# Altium schematic sheet Supply.SchDoc
size A4
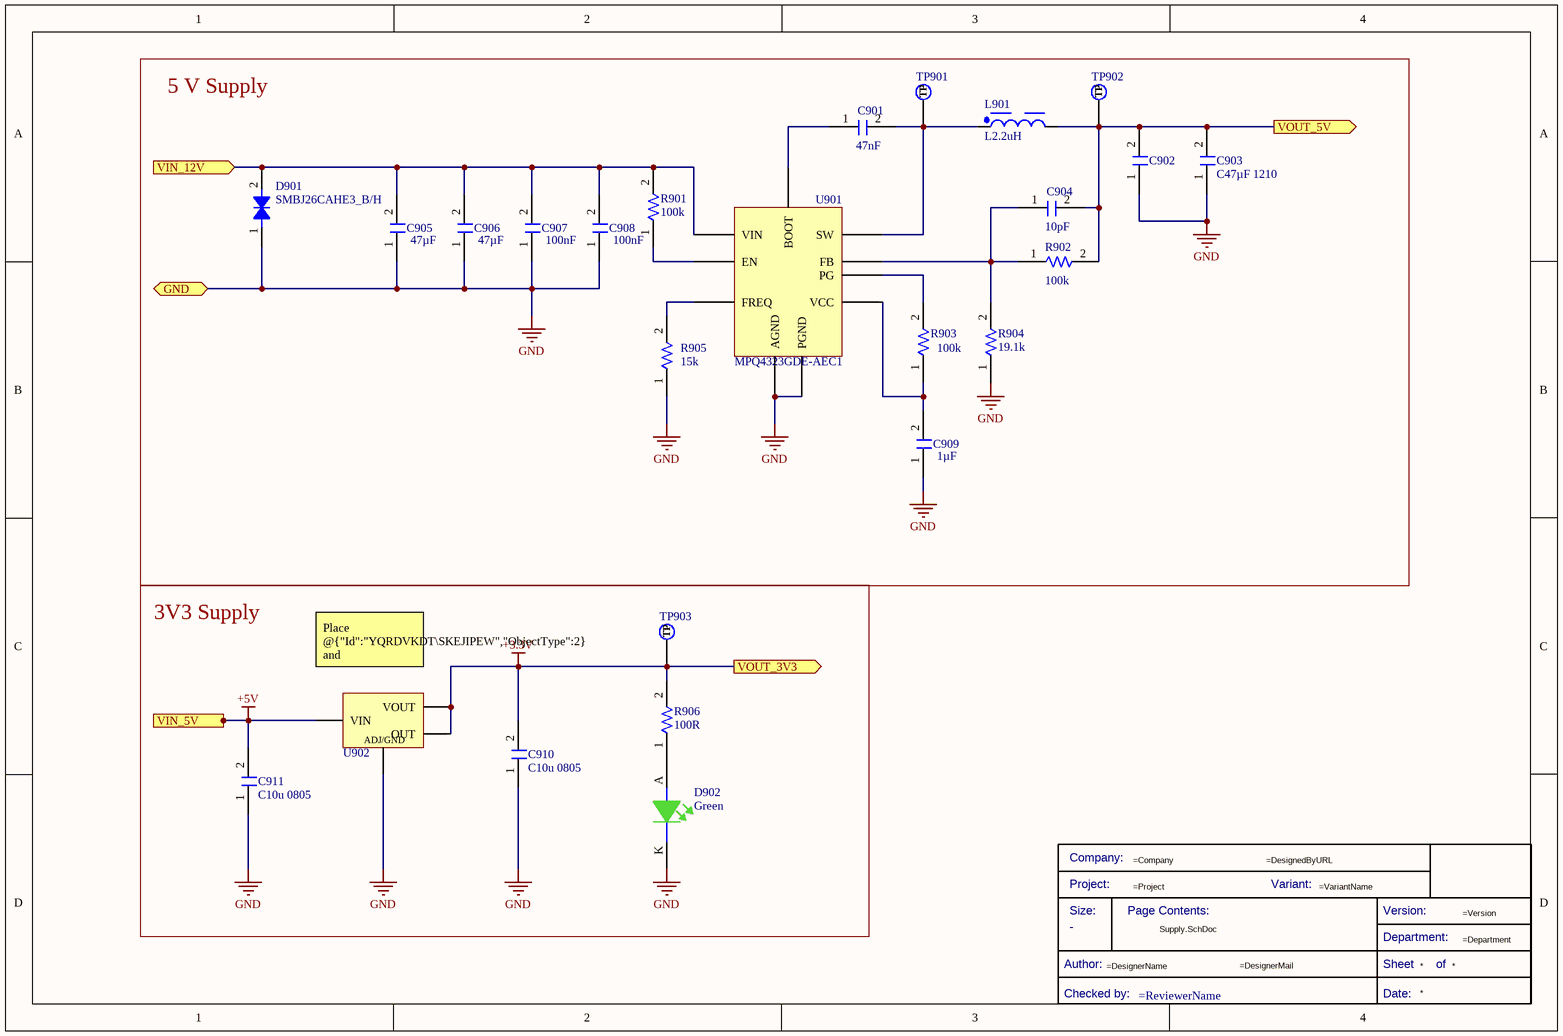
[diagram p0: Supply.SchDoc]

## Parts
*  Title Block_template  (value not drawn)  (graphical)
C901  value 47nF  [WCAP-CSGP_0805_L2W1.25H0.8_Reflow]  (hidden comment: 885012207096)
C902  C47µF 1210  [FP-GRM32E-0_3-0_2-IPC_C]  (value not drawn)
C903  C47µF 1210  [FP-GRM32E-0_3-0_2-IPC_C]
C904  value 10pF  [WCAP-CSGP_0805_L2W1.25H0.6_Reflow]  (hidden comment: C10pF_0805_50V)
C905  value 47µF  [FP-GRM32E-0_3-0_2-IPC_C]  (hidden comment: C47µF-10V-1210)
C906  value 47µF  [FP-GRM32E-0_3-0_2-IPC_C]  (hidden comment: C47µF-10V-1210)
C907  value 100nF  [C0805FNPC-R]  (hidden comment: C100n-50V-0805FNPC-X7R)
C908  value 100nF  [C0805FNPC-R]  (hidden comment: C100n-50V-0805FNPC-X7R)
C909  value 1µF  [C0805FNPC-R]  (hidden comment: C1u-50V-0805FNPC-X7R)
C910  C10u 0805  [C0805FNPC-R]
C911  C10u 0805  [C0805FNPC-R]
D901  SMBJ26CAHE3_B/H  [CAPM3216X18N]
D902  Color: Green  [LED_0805_WE]  (hidden comment: 150080VS75000)
L901  L2.2uH  [WE-PD_7345]
R901  value 100k  [RESC2013X70X40NL20T20]  (hidden comment: R100k-0805)
R902  value 100k  [RESC2013X70X40NL20T20]  (hidden comment: R100k-0805)
R903  value 100k  [RESC2013X70X40NL20T20]  (hidden comment: R100k-0805)
R904  value 19.1k  [0805]  (hidden comment: R19.1k_0805)
R905  value 15k  [RESC2013X50X30ML20T20]  (hidden comment: R15K-0805)
R906  Resistance: 100R  [R0805FTK]  (hidden comment: CR0805-FX-1000ELF)
TP901  TestPoint  [TestPoint]  (value not drawn)  (no BOM)
TP902  TestPoint  [TestPoint]  (value not drawn)  (no BOM)
TP903  TestPoint  [TestPoint]  (value not drawn)  (no BOM)
U901  MPQ4323GDE-AEC1  [MPQ4323]
U902  LM1117IMP-3.3/NOPB  [LDO_10V-0.8/3V3-SOT223]  (value not drawn)

## Blocks framed on the sheet
5 V Supply: C901-C909 D901 L901 R901-R905 TP901 TP902 U901
3V3 Supply: C910 C911 D902 R906 TP903 U902

## Ports
GND (bidir), VIN_5V (in), VIN_12V (in), VOUT_3V3 (out), VOUT_5V (out)

## Nets
+3.3V: C910.2 R906.2 TP903.1(TP) U902.2(OUT) U902.4(VOUT) ; port VOUT_3V3
+5V: C911.2 U902.3(VIN) ; port VIN_5V
GND: C902.1 C903.1 C905.1 C906.1 C907.1 C908.1 C909.1 C910.1 C911.1 D901.1 D902.K R904.1 R905.1 U901.4(AGND) U901.5(PGND) U902.1(ADJ/GND) ; port GND
VIN_12V: C905.2 C906.2 C907.2 C908.2 D901.2 R901.2 U901.1(VIN) ; port VIN_12V
VOUT_5V: C902.2 C903.2 C904.2 L901.2 R902.2 TP902.1(TP) ; port VOUT_5V
NetC901_1: C901.1 U901.10(BOOT)
NetC901_2: C901.2 L901.1 TP901.1(TP) U901.9(SW)
NetC904_1: C904.1 R902.1 R904.2 U901.8(FB)
NetC909_2: C909.2 R903.1 U901.6(VCC)
NetD902_A: D902.A R906.1
NetR901_1: R901.1 U901.2(EN)
NetR903_2: R903.2 U901.7(PG)
NetR905_2: R905.2 U901.3(FREQ)

## Notes on the sheet
- (near U902) Place @{"Id":"YQRDVKDT\SKEJIPEW","ObjectType":2} and @{"Id":"YQRDVKDT\BVAKXSFV","ObjectType":2} near @{"Id":"YQRDVKDT\LSHDRFIT","ObjectType":2}
- (in symbol Title Block_template) Company:; Project:; Variant:; Size:; Page Contents:; Version:; Department:; Author:; Sheet; of; Checked by:; Date:

## Library data of the parts
* = Title Block_template: Standard Title Block; .Creator: GP; Category: Title Block; .PCBcheck: GP; .SCHcheck: GP; Checked by:: =ReviewerName; Size: -
C901 = CMP-001-00011-1: Ceramic Capacitor, Ceramic; RoHS Compliant: Yes; Capacitor Type: Ceramic; Pins: 2
C902 C903 = CMP-001-00003-4: Ceramic Capacitor, Multilayer, Ceramic, 10V, 10% +Tol, 10% -Tol, X6S, 22% TC, 47uF, Surface Mount, 1210; Value: 47µF; Capacitor Type: Ceramic; Min Operating Temperature: -55°C; Pins: 2; RoHS Compliant: Yes; Case/Package: 1210; Max Operating Temperature: 105°C; Mounting Technology: Surface Mount
C904 = CMP-001-00012-2: Ceramic Capacitor, Multilayer, Ceramic, 50V, 5% +Tol, 5% -Tol, C0G, 30ppm/Cel TC, 0.00001uF, Surface Mount, 0805. 885012007051; Pins: 2; RoHS Compliant: Yes; Capacitor Type: Ceramic
C905 C906 = CMP-001-00003-4: Ceramic Capacitor, Multilayer, Ceramic, 10V, 10% +Tol, 10% -Tol, X6S, 22% TC, 47uF, Surface Mount, 1210; Capacitor Type: Ceramic; Min Operating Temperature: -55°C; Pins: 2; RoHS Compliant: Yes; Case/Package: 1210; Max Operating Temperature: 105°C; Mounting Technology: Surface Mount
C907 C908 = CMP-00063-1: Cap, 0.1ΜF, 50V, 10%, X7R, 0805; Manufacturer 1: Wurth Electronics; Manufacturer Part Number 1: 885012207098; .Creator: DR; Pricing 1: 100=0,10200, 500=0,07100, 2000=0,06100 (GBP); ComponentLink1URL: http://www.farnell.com/datasheets/1958498.pdf?src-supplier=Farnell; Design Item ID: C100n-50V-0805FNPC-X7R; Voltage Rating (DC): 50V; Voltage Rating: 50V; Max Operating Temperature: 125°C; RoHS: Yes; Case Code (Metric): 2012; Mount: Surface Mount; REACH SVHC: Unknown; Stock 1: 8000; Source: Passives.SchLib; Tolerance: 10%; RoHS Compliant: Yes; Dielectric: X7R; ComponentLink2Description: http://www.farnell.com/datasheets/1958498.pdf?src-supplier=Element14; ComponentLink2URL: http://www.farnell.com/datasheets/1958498.pdf?src-supplier=Element14; Min Operating Temperature: -55°C; Width: 0.049inch; Category: Ceramic Capacitors; Thickness: 0.035inch; Length: 0.079inch; ComponentLink3URL: https://katalog.we-online.de/pbs/datasheet/885012207098.pdf?src-supplier=Digi-Key; Case/Package: 0805; ComponentLink3Description: https://katalog.we-online.de/pbs/datasheet/885012207098.pdf?src-supplier=Digi-Key; Packaging: Cut Tape; ComponentLink1Description: http://www.farnell.com/datasheets/1958498.pdf?src-supplier=Farnell; ComponentLink4Description: http://www.farnell.com/datasheets/1958498.pdf?src-supplier=Newark; ComponentLink4URL: http://www.farnell.com/datasheets/1958498.pdf?src-supplier=Newark
C909 = CMP-00052-1: Multilayer Ceramic Capacitor, Wcap-Csgp Series, 1 F, 10%, X7R, 50 V, 0805 [2012 Metric] Rohs Compliant: Yes; Manufacturer Part Number 1: 885012207103; Manufacturer 1: Wurth Electronics; Voltage Rating (DC): 50V; .Creator: GP; Max Operating Temperature: 85°C; Case/Package: 0805; ComponentLink1Description: http://www.farnell.com/datasheets/1958501.pdf?src-supplier=Farnell; Design Item ID: C1u-50V-0805FNPC-X7R; ComponentLink1URL: http://www.farnell.com/datasheets/1958501.pdf?src-supplier=Farnell; ComponentLink2Description: http://www.farnell.com/datasheets/1958501.pdf?src-supplier=Element14; ComponentLink3URL: https://katalog.we-online.de/pbs/datasheet/885012107003.pdf?src-supplier=Digi-Key; ComponentLink4Description: http://www.farnell.com/datasheets/1958501.pdf?src-supplier=Newark; Width: 0.049inch; RoHS Compliant: Yes; Case Code (Metric): 2012; Source: Passives.SchLib; Category: Ceramic Capacitors; Tolerance: 10%; Pricing 1: 50=0,27200, 250=0,25300, 500=0,22800, 1250=0,20100, 2500=0,17100 (GBP); RoHS: Yes; Mount: Surface Mount; Min Operating Temperature: -55°C; ComponentLink4URL: http://www.farnell.com/datasheets/1958501.pdf?src-supplier=Newark; Dielectric: X7R; ComponentLink3Description: https://katalog.we-online.de/pbs/datasheet/885012107003.pdf?src-supplier=Digi-Key; ComponentLink2URL: http://www.farnell.com/datasheets/1958501.pdf?src-supplier=Element14; REACH SVHC: Unknown; Length: 0.079inch; Packaging: Cut Tape; Thickness: 0.053inch; Stock 1: 5100; Voltage Rating: 50V
C910 C911 = CMP-00055-6: Multilayer Ceramic Capacitor, Wcap-Csgp Series, 10 F, 20%, X5R, 16 V, 0805 [2012 Metric] Rohs Compliant: Yes; Manufacturer 1: Wurth Electronics; Manufacturer Part Number 1: 885012107014; .Creator: DR; Voltage Rating: 16V; Value: 10µF; Max Operating Temperature: 85°C; Stock 1: 81550; Pricing 1: 50=0,21000, 250=0,20200, 500=0,19100, 1000=0,17400, 2500=0,14700 (GBP); Length: 0.079inch; Dielectric: X5R; ComponentLink3Description: https://katalog.we-online.de/pbs/datasheet/885012107014.pdf?src-supplier=Digi-Key; RoHS: Yes; ComponentLink2URL: http://www.farnell.com/datasheets/1958454.pdf?src-supplier=Element14; ComponentLink1URL: http://www.farnell.com/datasheets/1958454.pdf?src-supplier=Farnell; Width: 0.049inch; Min Operating Temperature: -55°C; REACH SVHC: Unknown; Source: Passives.SchLib; ComponentLink1Description: http://www.farnell.com/datasheets/1958454.pdf?src-supplier=Farnell; Category: Ceramic Capacitors; ComponentLink2Description: http://www.farnell.com/datasheets/1958454.pdf?src-supplier=Element14; Case Code (Metric): 2012; Case/Package: 0805; Packaging: Cut Tape; ComponentLink4URL: http://www.farnell.com/datasheets/1958454.pdf?src-supplier=Newark; RoHS Compliant: Yes; Thickness: 0.057inch; Design Item ID: C10u-16V-0805FNPC-X5R; ComponentLink4Description: http://www.farnell.com/datasheets/1958454.pdf?src-supplier=Newark; Tolerance: 20%; Mount: Surface Mount; ComponentLink3URL: https://katalog.we-online.de/pbs/datasheet/885012107014.pdf?src-supplier=Digi-Key; Voltage Rating (DC): 16V
D901 = CMP-004-00009-2: Diodos TVS 600W,26V 5%,BIDIR,SMB TVS
D902 = LEDVS-0805-40: Led, Green, 570 Nm, 2 V, 30 Ma, 40 Mcd Rohs Compliant: Yes; Manufacturer 1: Wurth Electronics; Luminous Intensity: 40mcd; Forward Current: 30mA; Forward Voltage: 2V; Viewing Angle: 140°; Wavelength: 570nm; Lens Style: Clear,Rectangular; Test Current: 20mA; .Creator: DR; ComponentLink1Description: Datasheet; ComponentLink1URL: https://www.we-online.com/catalog/datasheet/150080VS75000.pdf; ComponentLink2Description: Where buy it; ComponentLink2URL: https://katalog.we-online.de/en/led/WL-SMCW/150080VS75000; Supplier 1: RSComponents; Manufacturer Part Number 1: 150080VS75000; RoHS: Yes; Category: LEDs; Stock 1: 850; Pricing 1: 50=0,19300, 500=0,12900, 1000=0,12300, 2000=0,11700, 4000=0,11100 (USD); Mount: Surface Mount; Case/Package: 0805; Case Code (Metric): 2012; Case Code (Imperial): 0805; Min Operating Temperature: -40°C; Max Operating Temperature: 85°C; Package Quantity: 4000; Packaging: Tape and Reel; Dominant Wavelength: 570nm; Length: 2mm; Width: 1.25mm; Height: 0.7mm; REACH SVHC: Unknown; ComponentLink3URL: https://datasheet.ciiva.com/22656/150080vs75000-22656966.pdf?src-supplier=Element14; ComponentLink3Description: https://datasheet.ciiva.com/22656/150080vs75000-22656966.pdf?src-supplier=Element14; ComponentLink4URL: https://datasheet.ciiva.com/29279/759437-da-01-en-chipled-0805-w-kl-h-gruen-150080vs7500-29279047.pdf?src-supplier=Conrad; ComponentLink4Description: https://datasheet.ciiva.com/29279/759437-da-01-en-chipled-0805-w-kl-h-gruen-150080vs7500-29279047.pdf?src-supplier=Conrad; ComponentLink5URL: https://datasheet.ciiva.com/29563/150080vs75000-29563018.pdf?src-supplier=Digi-Key; ComponentLink5Description: https://datasheet.ciiva.com/29563/150080vs75000-29563018.pdf?src-supplier=Digi-Key; Supplier Part Number 1: 8154237
L901 = CMP-006-00004-1: General Purpose Inductor, 2.2uH, 20%, 1 Element, Ferrite-Core, SMD. 744777002; Max Current Rating: 6A; Self Resonant Frequency: 60MHz; Pins: 2; RoHS Compliant: Yes; Tolerance: 20%; Min Operating Temperature: -40°C; Max Operating Temperature: 125°C
R901-R903 = CMP-009-00003-2: Fixed Resistor, Metal Glaze/thick Film, 0.125W, 100000ohm, 150V, 5% +/-Tol, 200ppm/Cel, Surface Mount, 0805; Power: 125mW; Max Operating Temperature: 155°C; Mounting Technology: Surface Mount; RoHS Compliant: Yes; Min Operating Temperature: -55°C; Pins: 2; Case/Package: 0805; Tolerance: 5%
R904 = CMP-009-00013-1: Fixed Resistor, Thin Film, 0.125W, 19100ohm, 100V, 0.1% +/-Tol, 15ppm/Cel, Surface Mount, 0805. ERA6APB1912V; Power: 125mW; Tolerance: 0.1%; Min Operating Temperature: -55°C; Mounting Technology: Surface Mount; Case/Package: 0805; Max Operating Temperature: 155°C; Pins: 2; RoHS Compliant: Yes
R905 = CMP-009-00005-1: Fixed Resistor, Metal Glaze/thick Film, 0.125W, 15000ohm, 150V, 1% +/-Tol, 100ppm/Cel, Surface Mount, 0805; Power: 125mW; Min Operating Temperature: -55°C; Mounting Technology: Surface Mount; RoHS Compliant: No; Tolerance: 1%; Pins: 2; Max Operating Temperature: 155°C; Case/Package: 0805
R906 = R100-0805FTK: Res Thick Film 0805 100 Ohm 1% 1/8W ±100ppm/°C Molded SMD SMD Paper Tape on Plastic Reel; Manufacturer 1: Bourns; Power Rating: 125mW; Voltage Rating: 150V; .Creator: DR; Supplier 1: Arrow Electronics; Manufacturer Part Number 1: CR0805-FX-1000ELF; RoHS: Yes; Category: Chip SMD Resistors; Stock 1: 49802; Pricing 1: 1=0,05840, 10=0,03430, 25=0,01780, 100=0,00750, 250=0,00560, 500=0,00490, 3000=0,00470 (USD); Mount: Surface Mount; Case/Package: 0805; Number of Pins: 2; Contact Plating: Tin; Case Code (Imperial): 0805; Case Code (Metric): 2012; Min Operating Temperature: -55°C; Max Operating Temperature: 155°C; Tolerance: 1%; Resistor Type: Thick Film; Temperature Coefficient: 100ppm/°C; Packaging: Tape and Reel; Package Quantity: 1; Termination: SMD/SMT; Number of Terminations: 2; Max Power Dissipation: 125mW; Voltage Rating (DC): 150V; Features: Moisture Resistant; Series: CR0805; Resistance Tolerance: 1%; Construction: Rectangular; Technology: THICK FILM; Length: 2mm; Width: 1.25mm; Height: 0.5mm; Depth: 1.25mm; Thickness: 508um; Radiation Hardening: No; REACH SVHC: No SVHC; Military Standard: Not; RoHS Compliant: Yes; ComponentLink1URL: https://datasheet.ciiva.com/11809/0900766b80fcdb72-11809178.pdf?src-supplier=RSComponents; ComponentLink1Description: https://datasheet.ciiva.com/11809/0900766b80fcdb72-11809178.pdf?src-supplier=RSComponents; ComponentLink2URL: https://datasheet.ciiva.com/6547/chpreztr-6547413.pdf?src-supplier=Digi-Key; ComponentLink2Description: https://datasheet.ciiva.com/6547/chpreztr-6547413.pdf?src-supplier=Digi-Key; ComponentLink3URL: https://datasheet.ciiva.com/6547/chpreztr-6547414.pdf?src-supplier=Digi-Key; ComponentLink3Description: https://datasheet.ciiva.com/6547/chpreztr-6547414.pdf?src-supplier=Digi-Key; ComponentLink4URL: https://datasheet.ciiva.com/6547/chpreztr-6547415.pdf?src-supplier=Digi-Key; ComponentLink4Description: https://datasheet.ciiva.com/6547/chpreztr-6547415.pdf?src-supplier=Digi-Key; ComponentLink5URL: https://datasheet.ciiva.com/9120/chpreztr-9120744.pdf?src-supplier=Avnet; ComponentLink5Description: https://datasheet.ciiva.com/9120/chpreztr-9120744.pdf?src-supplier=Avnet; Supplier Part Number 1: CR0805-FX-1000ELF
TP901-TP903 = CMP-00042-1: Test Point 1x1 mm; .SCHcheck: GP; Category: TestPoint; Source: e-Tech_Racing.SchLib; .Creator: GP; .PCBcheck: GP; Design Item ID: TestPoint
U901 = CMP-031-00007-2: MPQ4323 – 42V LOAD DUMP, 3A, LOW IQ, SYNC STEP-DOWN CONVERTER, AEC-Q100; pin to pad: 1>2+10 2>9 3>4 4>6 5>1+11 6>5 7>8 8>7 9>12 10>3; Min Supply Voltage: 3.3V; Max Supply Voltage: 36V; Max Operating Temperature: 150°C; RoHS Compliant: Yes; Min Operating Temperature: -40°C; Pins: 12; Mounting Technology: SMD; Case/Package: QFN12 (2mmx3mm)
U902 = LDO_10V-0.8/3V3-SOT223: LDO Regulator Pos 3.3V 0.8A 4-Pin(3+Tab) SOT-223 T/R / IC REG LDO 3.3V 0.8A SOT223; Manufacturer: Texas Instruments; Number of Outputs: 1; Max Input Voltage: 15V; Max Output Current: 800mA; Polarity: Positive; Quiescent Current: 15mA; Accuracy: 1%; Output Type: Fixed; Dropout Voltage: 1.2V; Min Input Voltage: 2.6V; Max Supply Voltage: 10V; Min Supply Voltage: 4.75V; Current Rating: 800A; .Creator: GP; ComponentLink1URL: https://www.ti.com/lit/ds/symlink/lm1117.pdf?HQS=dis-mous-null-mousermode-dsf-pf-null-wwe&DCM=yes&ref_url=https%3A%2F%2Fwww.mouser.de%2F&distId=26; ComponentLink1Description: Datasheet; ComponentLink2Description: Where buy it; ComponentLink2URL: https://www.mouser.es/ProductDetail/Texas-Instruments/LM1117IMP-33-NOPB?qs=X1J7HmVL2ZFbpN1TgOsjYQ%3D%3D; Supplier 1: Digi-Key; Manufacturer Part Number: LM1117IMP-3.3/NOPB; RoHS: Yes; Category: LDO; Pricing 1: 1=1,41000, 10=1,26300, 25=1,19920, 100=0,98500, 250=0,92072, 500=0,81366 (USD); Mount: Surface Mount; Case/Package: SOT-223; Number of Pins: 4; Min Operating Temperature: -40°C; Max Operating Temperature: 125°C; Output Voltage: 3.3V; Packaging: Tape and Reel; Output Current: 800mA; Nominal Output Voltage: 3.3V; Termination: SMD/SMT; Output Voltage Accuracy: 1%; Number of Regulators: 1; Min Current Limit: 800mA; Package Quantity: 1000; Length: 6.5mm; Width: 3.56mm; Height: 1.6mm; Radiation Hardening: No; REACH SVHC: No SVHC; Lead Free: Lead Free; RoHS Compliant: Yes; ComponentLink3URL: https://datasheet.ciiva.com/27051/1281318-27051810.pdf?src-supplier=Jameco; ComponentLink3Description: https://datasheet.ciiva.com/27051/1281318-27051810.pdf?src-supplier=Jameco; ComponentLink4URL: https://datasheet.ciiva.com/8042/1670636-8042261.pdf?src-supplier=Element14; ComponentLink4Description: https://datasheet.ciiva.com/8042/1670636-8042261.pdf?src-supplier=Element14; ComponentLink5URL: https://datasheet.ciiva.com/1570/1849796-1570171.pdf?src-supplier=Farnell; ComponentLink5Description: https://datasheet.ciiva.com/1570/1849796-1570171.pdf?src-supplier=Farnell; ComponentLink6URL: https://datasheet.ciiva.com/14149/lm1117-eng-tds-14149980.pdf?src-supplier=Distrelec; ComponentLink6Description: https://datasheet.ciiva.com/14149/lm1117-eng-tds-14149980.pdf?src-supplier=Distrelec; ComponentLink7URL: https://datasheet.ciiva.com/46386/1882372-46386042.pdf?src-supplier=Element14; ComponentLink7Description: https://datasheet.ciiva.com/46386/1882372-46386042.pdf?src-supplier=Element14; ComponentLink8URL: https://datasheet.ciiva.com/3223/lm1117-n-3223515.pdf?src-supplier=Avnet; ComponentLink8Description: https://datasheet.ciiva.com/3223/lm1117-n-3223515.pdf?src-supplier=Avnet; ComponentLink9URL: https://datasheet.ciiva.com/6580/lm1117-n-6580030.pdf?src-supplier=Digi-Key; ComponentLink9Description: https://datasheet.ciiva.com/6580/lm1117-n-6580030.pdf?src-supplier=Digi-Key; ComponentLink10URL: https://datasheet.ciiva.com/6580/lm1117-n-6580026.pdf?src-supplier=Digi-Key; ComponentLink10Description: https://datasheet.ciiva.com/6580/lm1117-n-6580026.pdf?src-supplier=Digi-Key; Supplier Part Number 1: LM1117IMP-3.3/NOPBCT-ND